# Altium schematic sheet Dental Support V200.SchDoc
size A4; Date: 16-09-2022; Engineer: Christian Peppelman; Revision: V200; SheetNumber: 1; SheetTotal: 1; ProjectSheetName: Dental Sensor Support Platform; SheetName: Main
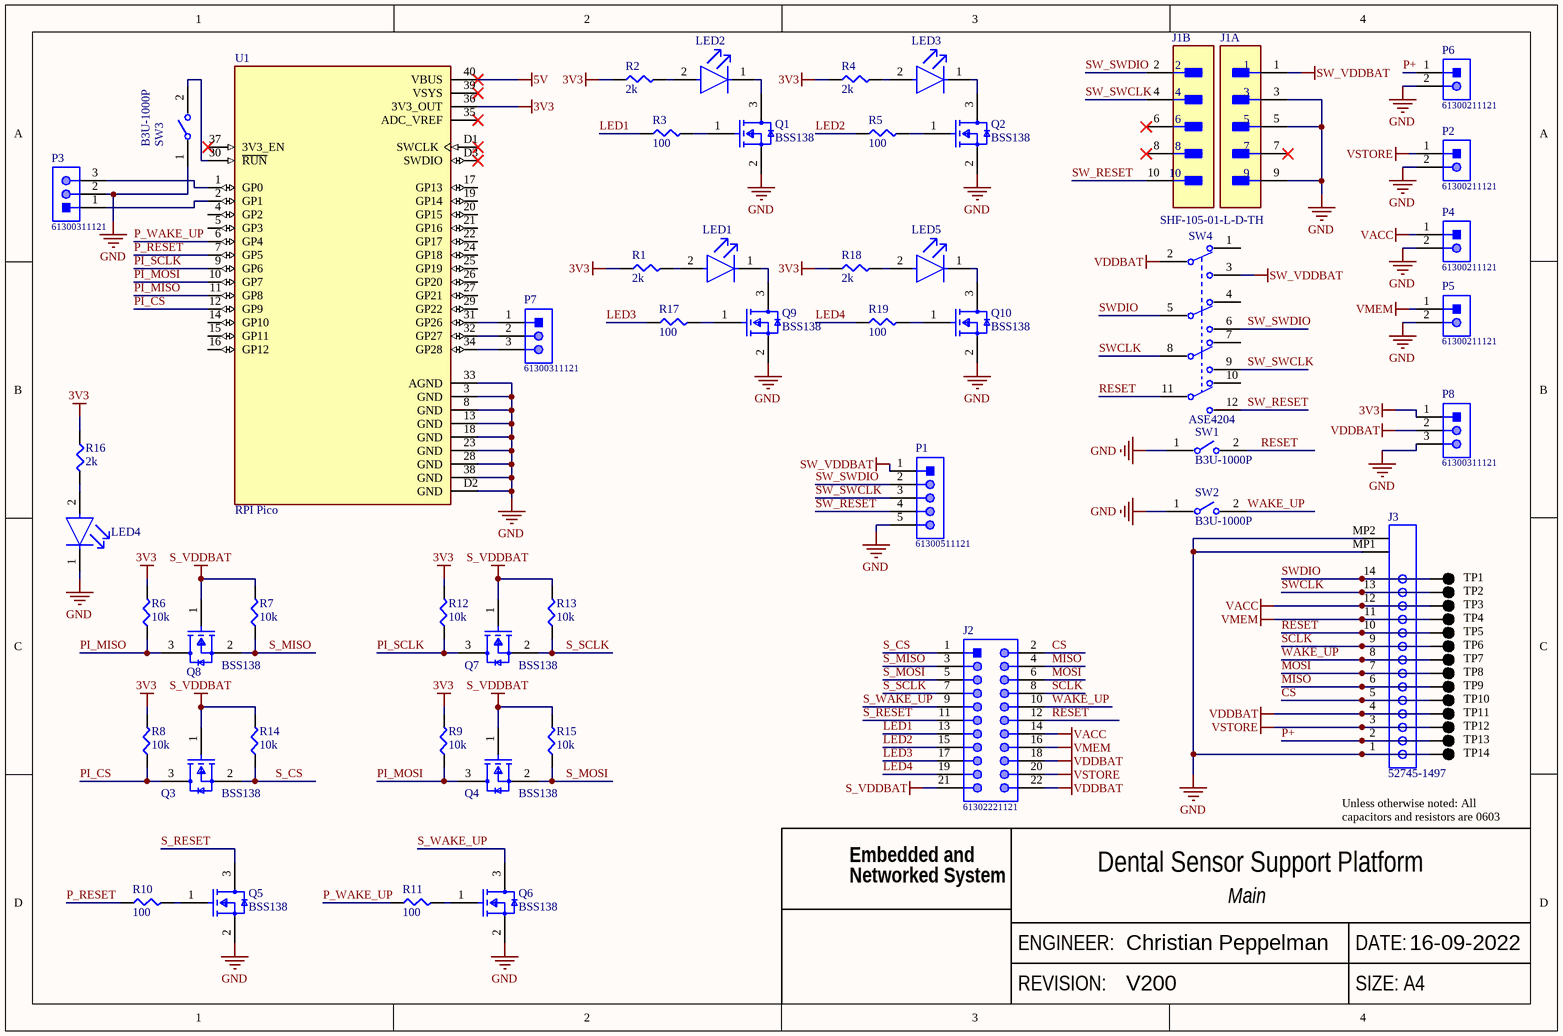
[diagram p0: Dental Support V200.SchDoc]

## Parts
J1  SHF-105-01-L-D-TH  [FP-SHF-105-01-L-D-TH-MFG]  (value not drawn)  (parts A,B of 2)
J2  61302221121  [61302221121]
J3  52745-1497  [MOLX-52745-1497]
LED1  150080SS75000  [FP-150080SS75000-MFG]  (value not drawn)
LED2  150080SS75000  [FP-150080SS75000-MFG]  (value not drawn)
LED3  150080SS75000  [FP-150080SS75000-MFG]  (value not drawn)
LED4  150080SS75000  [FP-150080SS75000-MFG]  (value not drawn)
LED5  150080SS75000  [FP-150080SS75000-MFG]  (value not drawn)
P1  61300511121  [61300511121]
P2  61300211121  [61300211121]
P3  61300311121  [61300311121]
P4  61300211121  [61300211121]
P5  61300211121  [61300211121]
P6  61300211121  [61300211121]
P7  61300311121  [61300311121]
P8  61300311121  [61300311121]
Q1  BSS138  [FP-318-08-IPC_B]
Q2  BSS138  [FP-318-08-IPC_B]
Q3  BSS138  [FP-318-08-IPC_B]
Q4  BSS138  [FP-318-08-IPC_B]
Q5  BSS138  [FP-318-08-IPC_B]
Q6  BSS138  [FP-318-08-IPC_B]
Q7  BSS138  [FP-318-08-IPC_B]
Q8  BSS138  [FP-318-08-IPC_B]
Q9  BSS138  [FP-318-08-IPC_B]
Q10  BSS138  [FP-318-08-IPC_B]
R1  2k  [RESC2012X06N]
R2  2k  [RESC2012X06N]
R3  100  [RESC2012X06N]
R4  2k  [RESC2012X06N]
R5  100  [RESC2012X06N]
R6  10k  [RESC2012X06N]
R7  10k  [RESC2012X06N]
R8  10k  [RESC2012X06N]
R9  10k  [RESC2012X06N]
R10  100  [RESC2012X06N]
R11  100  [RESC2012X06N]
R12  10k  [RESC2012X06N]
R13  10k  [RESC2012X06N]
R14  10k  [RESC2012X06N]
R15  10k  [RESC2012X06N]
R16  2k  [RESC2012X06N]
R17  100  [RESC2012X06N]
R18  2k  [RESC2012X06N]
R19  100  [RESC2012X06N]
SW1  B3U-1000P  [FP-B3U-1000P-MFG]
SW2  B3U-1000P  [FP-B3U-1000P-MFG]
SW3  B3U-1000P  [FP-B3U-1000P-MFG]
SW4  ASE4204  [FP-ASE4204-MFG]
TP1  5011  [KSTN-5011_V]  (value not drawn)
TP2  5011  [KSTN-5011_V]  (value not drawn)
TP3  5011  [KSTN-5011_V]  (value not drawn)
TP4  5011  [KSTN-5011_V]  (value not drawn)
TP5  5011  [KSTN-5011_V]  (value not drawn)
TP6  5011  [KSTN-5011_V]  (value not drawn)
TP7  5011  [KSTN-5011_V]  (value not drawn)
TP8  5011  [KSTN-5011_V]  (value not drawn)
TP9  5011  [KSTN-5011_V]  (value not drawn)
TP10  5011  [KSTN-5011_V]  (value not drawn)
TP11  5011  [KSTN-5011_V]  (value not drawn)
TP12  5011  [KSTN-5011_V]  (value not drawn)
TP13  5011  [KSTN-5011_V]  (value not drawn)
TP14  5011  [KSTN-5011_V]  (value not drawn)
U1  RPI Pico  [RPI Pico]

## Nets
3V3: P8.1 R1.1 R2.1 R4.1 R6.2 R8.2 R9.2 R12.2 R16.1 R18.1 U1.36(3V3_OUT)
5V: U1.40(VBUS)
GND: J1.3 J1.5 J1.9 J3.1 J3.MP1 J3.MP2 LED4.1(C) P1.5 P2.2 P3.2 P4.2 P5.2 P6.2 P8.3 Q1.2(S) Q2.2(S) Q5.2(S) Q6.2(S) Q9.2(S) Q10.2(S) SW1.1 SW2.1 SW3.1 TP14.1 U1.3(GND) U1.8(GND) U1.13(GND) U1.18(GND) U1.23(GND) U1.28(GND) U1.33(AGND) U1.38(GND) U1.D2(GND)
S_VDDBAT: J2.21 Q3.1(G) Q4.1(G) Q7.1(G) Q8.1(G) R7.2 R13.2 R14.2 R15.2
SW_VDDBAT: J1.1 P1.1 SW4.3
VACC: J2.14 J3.12 P4.1 TP3.1
VDDBAT: J2.18 J2.22 J3.4 P8.2 SW4.2 TP11.1
VMEM: J2.16 J3.11 P5.1 TP4.1
VSTORE: J2.20 J3.3 P2.1 TP12.1
CS: J2.2 J3.5 TP10.1
LED1: J2.13 R3.1
LED2: J2.15 R5.1
LED3: J2.17 R17.1
LED4: J2.19 R19.1
MISO: J2.4 J3.6 TP9.1
MOSI: J2.6 J3.7 TP8.1
P+: J3.2 P6.1 TP13.1
P_RESET: R10.1 U1.7(GP5)
P_WAKE_UP: R11.1 U1.6(GP4)
PI_CS: Q3.3(D) R8.1 U1.12(GP9)
PI_MISO: Q8.3(D) R6.1 U1.11(GP8)
PI_MOSI: Q4.3(D) R9.1 U1.10(GP7)
PI_SCLK: Q7.3(D) R12.1 U1.9(GP6)
RESET: J2.12 J3.10 SW1.2 SW4.11 TP5.1
S_CS: J2.1 Q3.2(S) R14.1
S_MISO: J2.3 Q8.2(S) R7.1
S_MOSI: J2.5 Q4.2(S) R15.1
S_RESET: J2.11 Q5.3(D)
S_SCLK: J2.7 Q7.2(S) R13.1
S_WAKE_UP: J2.9 Q6.3(D)
SCLK: J2.8 J3.9 TP6.1
SW_RESET: J1.10 P1.4 SW4.12
SW_SWCLK: J1.4 P1.3 SW4.9
SW_SWDIO: J1.2 P1.2 SW4.6
SWCLK: J3.13 SW4.8 TP2.1
SWDIO: J3.14 SW4.5 TP1.1
WAKE_UP: J2.10 J3.8 SW2.2 TP7.1
NetLED1_1: LED1.1(C) Q9.3(D)
NetLED1_2: LED1.2(A) R1.2
NetLED2_1: LED2.1(C) Q1.3(D)
NetLED2_2: LED2.2(A) R2.2
NetLED3_1: LED3.1(C) Q2.3(D)
NetLED3_2: LED3.2(A) R4.2
NetLED4_2: LED4.2(A) R16.2
NetLED5_1: LED5.1(C) Q10.3(D)
NetLED5_2: LED5.2(A) R18.2
NetP3_1: P3.1 U1.2(GP1)
NetP3_3: P3.3 U1.1(GP0)
NetP7_1: P7.1 U1.31(GP26)
NetP7_2: P7.2 U1.32(GP27)
NetP7_3: P7.3 U1.34(GP28)
NetQ1_1: Q1.1(G) R3.2
NetQ2_1: Q2.1(G) R5.2
NetQ5_1: Q5.1(G) R10.2
NetQ6_1: Q6.1(G) R11.2
NetQ9_1: Q9.1(G) R17.2
NetQ10_1: Q10.1(G) R19.2
NetSW3_2: SW3.2 U1.30(~{RUN})

Not connected (* = marked no-connect by the designer): J1 6* 7* 8*; SW4 1 4 7 10; U1 4(GP2) 5(GP3) 14(GP10) 15(GP11) 16(GP12) 17(GP13) 19(GP14) 20(GP15) 21(GP16) 22(GP17) 24(GP18) 25(GP19) 26(GP20) 27(GP21) 29(GP22) 35(ADC_VREF)* 37(3V3_EN)* 39(VSYS)* D1(SWCLK)* D3(SWDIO)*

## Notes on the sheet
- Unless otherwise noted: All capacitors and resistors are 0603
- Embedded and
- Networked System
- ENGINEER:
- DATE:
- REVISION:
- SIZE: A4

## Library data of the parts
J1 = CMP-02766-000059-1: CONN HEADER VERT 10POS 1.27MM; Manufacturer: Samtec; Standoff Height: 0.38mm; Conn Orientation: Vertical; Conn Gender: Male; Number Of Contacts: 10; Device Class L3: unset; Temperature Range Low: -55°C; Manufacturer Part Number: SHF-105-01-L-D-TH; Pitch: 1.27mm; RoHS: TRUE; Digikey Description: CONN HEADER VERT 10POS 1.27MM; ComponentLink2Description: Datasheet; Temperature: -55°C to +125°C; Lead Free: Yes; Device Class L1: Connectors; Height: 5.46mm; Category: Conn; Mouser Description: Conn Shrouded Header (4 Sides) HDR 10 POS 1.27mm Solder ST Thru-Hole Tube; Footprint Url: http://suddendocs.samtec.com/prints/shf-1xx-01-x-d-xx-xx-footprint.pdf; Number Of Rows: 2; Device Class L2: Headers and Wire Housings; Temperature Range High: +125°C; ComponentLink2URL: http://suddendocs.samtec.com/prints/shf-1xx-01-x-d-xx-xx-mkt.pdf; Automotive: No; Octopart: https://octopart.com/shf-105-01-l-d-th-samtec-17904677; Package: 0; Contact Material: Gold,Nickel
J2 = CMP-1502-01108-1: THT Vertical Pin Header WR-PHD, Pitch 2.54 mm, Dual Row, 22 pins; Manufacturer: Wurth Elektronik; Working Voltage: 250VAC; Pin Number: 22; Withstanding Voltage: 500VAC; Rated Current: 3A; Contact Resistance: 20mOhm; Gender: Male; Pitch: 2.54mm; Publisher: WurthElektronik; Part Number: 61302221121; Mounting Technology: THT; Row Number: Dual; Orientation: Vertical; Operating Temperature: -40to105degC; Manufacturer URL: http://www.we-online.de; Packaging: Bag; Datasheet URL: https://katalog.we-online.de/em/datasheet/6130xx21121.pdf; Package Reference: 61302221121
J3 = CMP-1241-00360-1: 0.5 mm Pitch Easy-On(TM) Type FPC Connector, 2.0 mm Mated Height, Right Angle, ZIF, SMT, Top Contact, 14 Circuits, -20 to 85 degC, ELV and RoHS Compliant, Tape and Reel; Manufacturer: Molex; Voltage (Max): 50V; Durability (mating cycles max): 20; Pitch - Mating Interface: 0.50mm; Mated Height: 2.00mm; Material - Metal: Phosphor Bronze; Entry Angle: 90degrees Angle; Polarized to PCB: Yes; Circuits (Loaded): 14; Stackable: No; Current (Max per Contact): 0.5A; Material - Plating Mating: Gold; ComponentLink2Description: Datasheet; Number of Rows: 1; Contact Position: Top; PackageReference: 52745-1497; ComponentLink1Description: Manufacturer URL; Orientation: Right Angle; ComponentLink3URL: http://www.molex.com/pdm_docs/sd/527451497_sd.pdf; PackageVersion: Rev. C, 07/2010; ComponentLink3Description: Package Specification; RoHS: TRUE; Packing: Tape and Reel; Mounting Technology: Surface Mount; ComponentLink1URL: http://www.molex.com/molex/index.jsp; PackageDescription: 14-Lead FPC Connector, Pitch 0.5 mm; PartNumber: 52745-1497; PCB Locator: No; PCB Retention: Yes; ComponentLink2URL: http://www.molex.com/webdocs/datasheets/pdf/en-us/0527451497_FFC_FPC_CONNECTORS.pdf; Material - Plating Termination: Gold
LED1-LED5 = CMP-1426-00010-2: LED RED CLEAR 0805 SMD; Forward Voltage: 1.9V; Luminous Intensity: 60mcd; Dominant Wavelength: 630nm; Forward Current: 30mA; Viewing Angle: 140°; Lens Color: Colorless; Test Current: 20mA; Lens Size: 1.25mm; Packaging: Cut Tape; Width: 1.25mm; Case Code (Metric): 2012; Max Operating Temperature: 85°C; RoHS Compliant: Yes; Mount: Surface Mount; Case/Package: 0805; Series: WL-SMCW; Length: 2mm; Case Code (Imperial): 0805; Wavelength: 630nm; Lens Style: Clear; Min Operating Temperature: -40°C; Color: Red; Lens Transparency: Clear; Package Quantity: 1; Height: 0.8mm
P1 = CMP-1502-01068-1: THT Vertical Pin Header WR-PHD, Pitch 2.54 mm, Single Row, 5 pins; Manufacturer: Wurth Elektronik; Pin Number: 5; Contact Resistance: 20mOhm; Working Voltage: 250VAC; Pitch: 2.54mm; Withstanding Voltage: 500VAC; Rated Current: 3A; Gender: Male; Datasheet URL: https://katalog.we-online.de/em/datasheet/6130xx11121.pdf; Orientation: Vertical; Mounting Technology: THT; Row Number: Single; Package Reference: 61300511121; Publisher: WurthElektronik; Part Number: 61300511121; Packaging: Bag; Manufacturer URL: http://www.we-online.de; Operating Temperature: -40to105degC
P2 P4-P6 = CMP-1712-00002-4: THT Vertical Pin Header WR-PHD, Pitch 2.54 mm, Single Row, 2 pins; Manufacturer: Wurth Elektronik; Rated Current: 3A; Gender: Male; Withstanding Voltage: 500VAC; Working Voltage: 250VAC; Pitch: 2.54mm; Contact Resistance: 20mOhm; Pin Number: 2; Mounting Technology: THT; Orientation: Vertical; Operating Temperature: -40to105degC; Packaging: Bag; Publisher: WurthElektronik; Datasheet URL: https://katalog.we-online.de/em/datasheet/6130xx11121.pdf; Manufacturer URL: http://www.we-online.de; Row Number: Single; Package Reference: 61300211121; Part Number: 61300211121
P3 P7 P8 = CMP-1502-01062-1: THT Vertical Pin Header WR-PHD, Pitch 2.54 mm, Single Row, 3 pins; Manufacturer: Wurth Elektronik; Withstanding Voltage: 500VAC; Working Voltage: 250VAC; Rated Current: 3A; Pitch: 2.54mm; Pin Number: 3; Gender: Male; Contact Resistance: 20mOhm; Package Reference: 61300311121; Manufacturer URL: http://www.we-online.de; Datasheet URL: https://katalog.we-online.de/em/datasheet/6130xx11121.pdf; Operating Temperature: -40to105degC; Part Number: 61300311121; Orientation: Vertical; Packaging: Bag; Row Number: Single; Mounting Technology: THT; Publisher: WurthElektronik
Q1-Q10 = CMP-07173-000101-1: MOSFET N-CH 50V 220MA SOT-23; Turn-Off Delay Time: 20ns; Element Configuration: Single; Rds On Max: 3.5R; Gate to Source Voltage (Vgs): 20V; Threshold Voltage: 1.3V; Number of Elements: 1; Power Dissipation: 360mW; Rise Time: 9ns; Turn-On Delay Time: 2.5ns; Input Capacitance: 27pF; On-State Resistance: 6R; Lead Free: Lead Free; Length: 2.92mm; Width: 1.3mm; Drain to Source Breakdown Voltage: 50V; Min Operating Temperature: -55°C; REACH SVHC: No SVHC; Packaging: Tape and Reel; Radiation Hardening: No; Height: 0.93mm; Drain to Source Voltage (Vdss): 50V; Current Rating: 220mA; Voltage Rating (DC): 50V; Weight: 0.03g; Continuous Drain Current (ID): 220mA; Number of Pins: 3; Nominal Vgs: 1.3V; Max Power Dissipation: 360mW; Fall Time: 9ns; Drain to Source Resistance: 3.5R; Contact Plating: Tin; Case/Package: SOT-23; Package Quantity: 1; Dual Supply Voltage: 50V; Mount: Surface Mount; Termination: SMD/SMT; Max Operating Temperature: 150°C
R1 R2 R4 R16 R18 = ERJ-6ENF2001V: RES SMD 2K OHM 1% 1/8W 0805; Manufacturer: Panasonic Electronic Components; Factory Stock: 0; Unit Price (USD): 0.00729; @ qty: 1500; Minimum Quantity: 1; Power (Watts): 0.125W, 1/8W; Temperature Coefficient: ±100ppm/°C; Part Number: ERJ-6ENF2001V; Datasheets: http://industrial.panasonic.com/www-cgi/jvcr13pz.cgi?E+PZ+3+AOA0002+ERJ6ENF2001V+7+WW; Image: //media.digikey.com/Renders/Panasonic%20Renders/ERJ-0805%20Pkg.jpg; Digi-Key Part Number: P2.00KCCT-ND; Quantity Available: 732688; Packaging: Cut Tape (CT); Series: ERJ; Part Status: Active; Value: 2k; Tolerance: ±1%; Composition: Thick Film; Features: Automotive AEC-Q200; Operating Temperature: -55°C ~ 155°C; Package / Case: 0805 (2012 Metric); Supplier Device Package: 0805; Size / Dimension: 0.079" L x 0.049" W (2.00mm x 1.25mm); Height - Seated (Max): 0.028" (0.70mm); Number of Terminations: 2; Failure Rate: -
R3 R5 R10 R11 R17 R19 = ERJ-6ENF1000V: RES SMD 100 OHM 1% 1/8W 0805; Manufacturer: Panasonic Electronic Components; Factory Stock: 0; Unit Price (USD): 0.00729; @ qty: 1500; Minimum Quantity: 1; Power (Watts): 0.125W, 1/8W; Temperature Coefficient: ±100ppm/°C; Part Number: ERJ-6ENF1000V; Datasheets: http://industrial.panasonic.com/www-cgi/jvcr13pz.cgi?E+PZ+3+AOA0002+ERJ6ENF1000V+7+WW; Image: //media.digikey.com/Renders/Panasonic%20Renders/ERJ-0805%20Pkg.jpg; Digi-Key Part Number: P100CCT-ND; Quantity Available: 288663; Packaging: Cut Tape (CT); Series: ERJ; Part Status: Active; Value: 100; Tolerance: ±1%; Composition: Thick Film; Features: Automotive AEC-Q200; Operating Temperature: -55°C ~ 155°C; Package / Case: 0805 (2012 Metric); Supplier Device Package: 0805; Size / Dimension: 0.079" L x 0.049" W (2.00mm x 1.25mm); Height - Seated (Max): 0.028" (0.70mm); Number of Terminations: 2; Failure Rate: -
R6-R9 R12-R15 = ERJ-6ENF1002V: RES SMD 10K OHM 1% 1/8W 0805; Manufacturer: Panasonic Electronic Components; Factory Stock: 0; Unit Price (USD): 0.00729; @ qty: 1500; Minimum Quantity: 1; Power (Watts): 0.125W, 1/8W; Temperature Coefficient: ±100ppm/°C; Part Number: ERJ-6ENF1002V; Datasheets: http://industrial.panasonic.com/www-cgi/jvcr13pz.cgi?E+PZ+3+AOA0002+ERJ6ENF1002V+7+WW; Image: //media.digikey.com/Renders/Panasonic%20Renders/ERJ-0805%20Pkg.jpg; Digi-Key Part Number: P10.0KCCT-ND; Quantity Available: 3985614; Packaging: Cut Tape (CT); Series: ERJ; Part Status: Active; Value: 10k; Tolerance: ±1%; Composition: Thick Film; Features: Automotive AEC-Q200; Operating Temperature: -55°C ~ 155°C; Package / Case: 0805 (2012 Metric); Supplier Device Package: 0805; Size / Dimension: 0.079" L x 0.049" W (2.00mm x 1.25mm); Height - Seated (Max): 0.028" (0.70mm); Number of Terminations: 2; Failure Rate: -
SW1-SW3 = CMP-2100-03586-2: SWITCH TACTILE SPST-NO 0.05A 12V; Contact Resistance: 100mR; Operating Force: 1.5N; Max Current Rating: 50mA; Switch Travel: 0.15mm; Actuator Type: Standard; Mechanical Life: 200000Cycles; Ratings: Dust Proof; Illumination Type: Non-Illuminated; Throw Configuration: SPST; Actuator Length: 0.4mm; Switch Function: Off-Mom; Height: 1.2mm; Width: 3mm; Weight: 0.000776oz; Contact Material: Silver; Max Voltage Rating (DC): 12V; Insulation Resistance: 100MR; Lead Free: Lead Free; Current Rating: 50mA; Termination: SMD/SMT; Length: 4mm; Voltage Rating (DC): 12V; Contact Current Rating: 50mA; Orientation: Straight; Depth: 2.5mm; Max Operating Temperature: 70°C; Packaging: Tape and Reel; Min Operating Temperature: -25°C; Package Quantity: 1; Mount: Surface Mount; Electrical Life: 200000Cycles
SW4 = CMP-03405-000007-1: Pushbutton Switch SPST-NO Keyswitch, Illuminated Through Hole; Actuator Type: SLIDE; Contact Current Rating: 300mA; Actuator Color: Natural; Throw Configuration: 4PDT; Actuator Material: Polyester; Max Voltage Rating (DC): 115V; Number of Positions: 2; Electrical Life: 15000Cycles; Number of Poles: 4; Contact Resistance: 40mR; REACH SVHC: No SVHC; Min Operating Temperature: -40°C; Current Rating: 300mA; Flammability Rating: UL94 V-0; Termination: Solder; RoHS Compliant: Yes; Contact Plating: Silver; Contact Material: Copper Alloy; Orientation: Vertical; Max Operating Temperature: 80°C; Packaging: Rail/Tube; Mount: Through Hole; Color: Natural; Voltage Rating (AC): 115V; Lead Free: Lead Free
TP1-TP14 = CMP-1672-00003-4: Test Point, Black, Through Hole, RoHS, Bulk; Manufacturer: Keystone; ComponentLink2URL: http://www.keyelco.com/product-pdf.cfm?p=1320; Colour: Black; Pins: 1; REACH SVHC: No SVHC; ComponentLink1URL: http://www.keyelco.com/; PackageReference: 5011; Contact Plating: Silver; Package Quantity: 100; Packaging: Bulk; RoHSCompliant: true; Height: 8.12 mm; PackageDescription: 1-Pin Through Hole Device, Dia 3.17 mm; Mount: Through Hole; Mounting Technology: Through Hole; DatasheetVersion: Rev. F, 12/2013; ComponentLink1Description: Manufacturer URL; Contact Material: Bronze; ComponentLink2Description: Datasheet